# Altium project FSAE Formula E PDM.PrjPcb
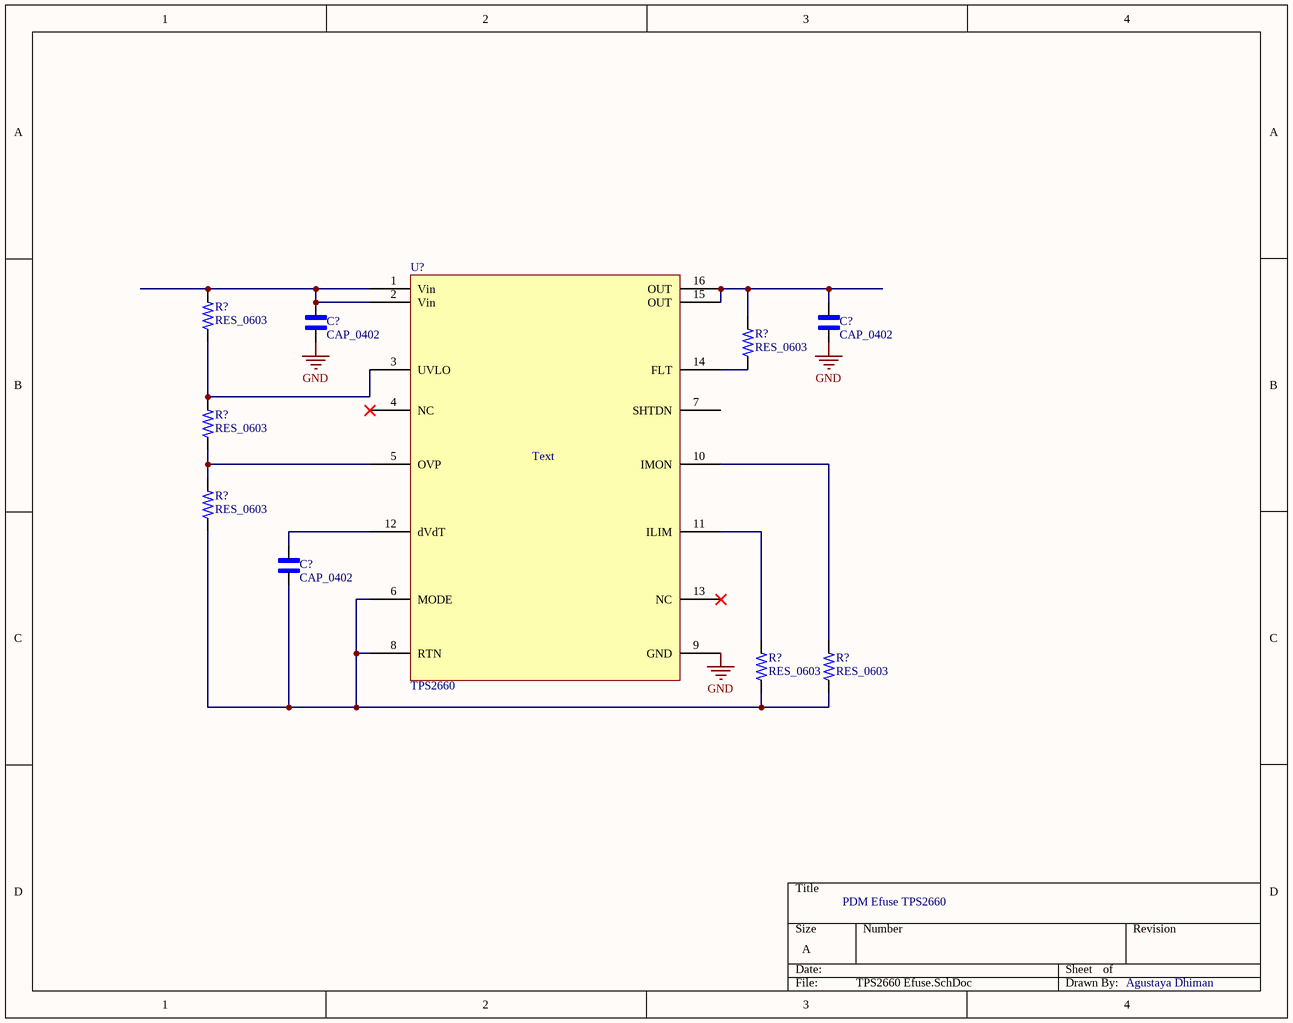
[diagram p0: TPS2660 Efuse.SchDoc]
3 sheets, 52 parts. Net scope: global (net labels, ports and power ports of the same name join across sheets).
Sheets:
  TPS2660 Efuse.SchDoc
  PDM_MCU_STM32F407GT6.SchDoc
  PDM_MCU_Power.SchDoc

## Sheet TPS2660 Efuse.SchDoc
size A; SheetNumber: 1; SheetTotal: 4

### Parts
(Parts that share a designator on the sheet are numbered #1, #2 ... from top to bottom, then left to right.)
C?#1  CAP_0402  [CAP_0402-Footprint-1]
C?#2  CAP_0402  [CAP_0402-Footprint-1]
C?#3  CAP_0402  [CAP_0402-Footprint-1]
R?#1  RES_0603  [RES_0603-Footprint-1]
R?#2  RES_0603  [RES_0603-Footprint-1]
R?#3  RES_0603  [RES_0603-Footprint-1]
R?#4  RES_0603  [RES_0603-Footprint-1]
R?#5  RES_0603  [RES_0603-Footprint-1]
R?#6  RES_0603  [RES_0603-Footprint-1]
U?#1  TPS2660

### Nets
GND: C?#1.1 C?#2.1 U?#1.9(GND)
NetC?#1_2: C?#1.2 R?#1.2 U?#1.1(Vin) U?#1.2(Vin)
NetC?#2_2: C?#2.2 R?#2.2 U?#1.15(OUT) U?#1.16(OUT)
NetC?#3_1: C?#3.1 R?#4.1 R?#5.1 R?#6.1 U?#1.6(MODE) U?#1.8(RTN)
NetC?#3_2: C?#3.2 U?#1.12(dVdT)
NetR?#1_1: R?#1.1 R?#3.2 U?#1.3(UVLO)
NetR?#2_1: R?#2.1 U?#1.14(FLT)
NetR?#3_1: R?#3.1 R?#4.2 U?#1.5(OVP)
NetR?#5_2: R?#5.2 U?#1.11(ILIM)
NetR?#6_2: R?#6.2 U?#1.10(IMON)

Not connected (* = marked no-connect by the designer): U?#1 4(NC)* 7(SHTDN) 13(NC)*

### Notes on the sheet
- PDM Efuse TPS2660
- Agustaya Dhiman
- (in symbol TPS2660) Text

### Library data of the parts
C?#1-C?#3 = CMP-00063-1: Generic 0402 Capacitor
R?#1-R?#6 = CMP-00013-5: 0603 Generic Resistor
U?#1 = TPS2660: TPS2660x, Efuse; ComponentLink1Description: DataSheet; ComponentLink1URL: https://www.ti.com/lit/ds/symlink/tps2660.pdf?ts=1762009075200

## Sheet PDM_MCU_STM32F407GT6.SchDoc
size A; SheetNumber: 3; SheetTotal: 4
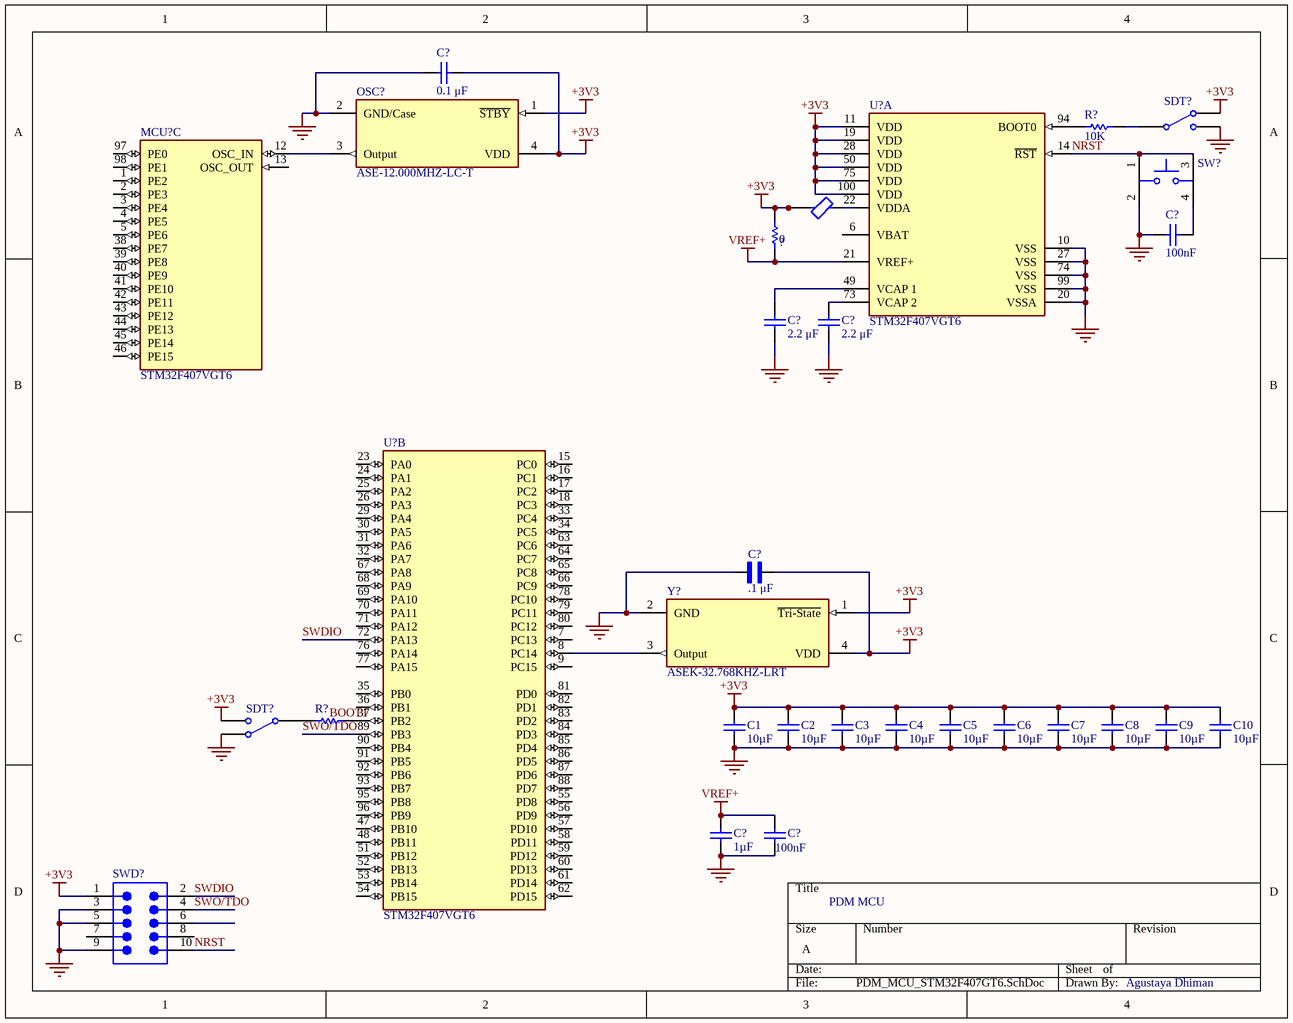
[diagram p1: PDM_MCU_STM32F407GT6.SchDoc]

### Parts
(Parts that share a designator on the sheet are numbered #1, #2 ... from top to bottom, then left to right.)
?  value 0  (hidden comment: Resistor)
C1  value 10µF  (hidden comment: Capacitor)
C2  value 10µF  (hidden comment: Capacitor)
C3  value 10µF  (hidden comment: Capacitor)
C4  value 10µF  (hidden comment: Capacitor)
C5  value 10µF  (hidden comment: Capacitor)
C6  value 10µF  (hidden comment: Capacitor)
C7  value 10µF  (hidden comment: Capacitor)
C8  value 10µF  (hidden comment: Capacitor)
C9  value 10µF  (hidden comment: Capacitor)
C10  value 10µF  (hidden comment: Capacitor)
C?#4  value 0.1 μF  (hidden comment: Capacitor)
C?#5  value 100nF  (hidden comment: Capacitor)
C?#6  value 2.2 μF  (hidden comment: Capacitor)
C?#7  value 2.2 μF  (hidden comment: Capacitor)
C?#8  .1 μF  [CAP_0603-Footprint]
C?#9  value 1µF  (hidden comment: Capacitor)
C?#10  value 100nF  (hidden comment: Capacitor)
FB?  BLM03BB750SZ1D  [FP-BLM03-0_03-d0_3-IPC_C]  (value not drawn)
MCU?  STM32F407VGT6  [FP-LQFP100-1L-MFG]  (part C of 3)
OSC?  ASE-12.000MHZ-LC-T  [FP-ASE-MFG]
R?#7  value 10K  (hidden comment: Resistor)
R?#8  Resistor  (value not drawn)
SDT?#1  Single-Pole, Double-Throw Switch  (value not drawn)
SDT?#2  Single-Pole, Double-Throw Switch  (value not drawn)
SW?  KT11P3JM34LFS  [FP-KT11P3JM34LFS-MFG]  (value not drawn)
SWD?  LTMM-105-02-T-D-SM  [SMTC-LTMM-105-02-X-D-SM]  (value not drawn)
U?#2  STM32F407VGT6  [FP-LQFP100-1L-MFG]  (part A of 3)
U?#3  STM32F407VGT6  [FP-LQFP100-1L-MFG]  (part B of 3)
Y?  ASEK-32.768KHZ-LRT  [FP-ASEK-ASEAIG-MFG]

### Nets
+3V3: ?.1 C1.2 C2.2 C3.2 C4.2 C5.2 C6.2 C7.2 C8.2 C9.2 C10.2 C?#4.2 C?#8.2 FB?.2 OSC?.1(~{STBY}) OSC?.4(VDD) SDT?#1.3 SDT?#2.2 SWD?.1 U?#2.11(VDD) U?#2.19(VDD) U?#2.28(VDD) U?#2.50(VDD) U?#2.75(VDD) U?#2.100(VDD) Y?.1(~{Tri-State}) Y?.4(VDD)
\: C?#4.1 C?#5.2 C?#8.1 OSC?.2(GND/Case) SW?.2 Y?.2(GND)
GND: C?#6.2 C?#7.2 SDT?#1.2 U?#2.10(VSS) U?#2.20(VSSA) U?#2.27(VSS) U?#2.74(VSS) U?#2.99(VSS)
NetC1_1: C1.1 C2.1 C3.1 C4.1 C5.1 C6.1 C7.1 C8.1 C9.1 C10.1 C?#9.1 C?#10.1 SDT?#2.3 SWD?.3 SWD?.5 SWD?.9
VREF+: ?.2 C?#9.2 C?#10.2 U?#2.21(VREF+)
NRST: SW?.1 SW?.3 SWD?.10 U?#2.14(~{RST})
SWDIO: SWD?.2 U?#3.72(PA13)
SWO/TDO: SWD?.4 U?#3.89(PB3)
NetC?#5_1: C?#5.1 SW?.4
NetC?#6_1: C?#6.1 U?#2.49(VCAP_1)
NetC?#7_1: C?#7.1 U?#2.73(VCAP_2)
NetFB?_1: FB?.1 U?#2.22(VDDA)
NetMCU?_12: MCU?.12(OSC_IN) OSC?.3(Output)
NetR?#7_1: R?#7.1 U?#2.94(BOOT0)
NetR?#7_2: R?#7.2 SDT?#1.1
NetR?#8_1: R?#8.1 SDT?#2.1
NetR?#8_2: R?#8.2 U?#3.37(PB2)
NetU?#3_8: U?#3.8(PC14) Y?.3(Output)

Not connected (* = marked no-connect by the designer): MCU? 1(PE2) 2(PE3) 3(PE4) 4(PE5) 5(PE6) 13(OSC_OUT) 38(PE7) 39(PE8) 40(PE9) 41(PE10) 42(PE11) 43(PE12) 44(PE13) 45(PE14) 46(PE15) 97(PE0) 98(PE1); SWD? 6 7 8; U?#2 6(VBAT); U?#3 7(PC13) 9(PC15) 15(PC0) 16(PC1) 17(PC2) 18(PC3) 23(PA0) 24(PA1) 25(PA2) 26(PA3) 29(PA4) 30(PA5) 31(PA6) 32(PA7) 33(PC4) 34(PC5) 35(PB0) 36(PB1) 47(PB10) 48(PB11) 51(PB12) 52(PB13) 53(PB14) 54(PB15) 55(PD8) 56(PD9) 57(PD10) 58(PD11) 59(PD12) 60(PD13) 61(PD14) 62(PD15) 63(PC6) 64(PC7) 65(PC8) 66(PC9) 67(PA8) 68(PA9) 69(PA10) 70(PA11) 71(PA12) 76(PA14) 77(PA15) 78(PC10) 79(PC11) 80(PC12) 81(PD0) 82(PD1) 83(PD2) 84(PD3) 85(PD4) 86(PD5) 87(PD6) 88(PD7) 90(PB4) 91(PB5) 92(PB6) 93(PB7) 95(PB8) 96(PB9)

### Notes on the sheet
- PDM MCU
- Agustaya Dhiman
- Labels drawn without touching a wire or pin: BOOT1

### Library data of the parts
? = Resistor: SimulationGenericComponent: True; TC1: 0; TC2: 0
C1-C10 C?#4-C?#7 C?#9 C?#10 = Capacitor: SimulationGenericComponent: True
C?#8 = CMP-022-000000-4: 0.1µF ±10% 50V Ceramic 0603; Manufacturer Part Number 1: CL10B104KB8NNNC; Manufacturer 1: Samsung Electro-Mechanics
FB? = CMP-06046-002018-1: Ferrite Bead, 0201, 75Ω @ 100MHz, 25%, 1Ω, 200mA; DC Resistance (DCR): 1R; Number of Lines: 1; Ratings: AEC-Q200; Max Current Rating: 200mA; Min Operating Temperature: -55°C; Max Operating Temperature: 125°C; RoHS Compliant: Yes; Case/Package: 0201; Mount: Surface Mount
MCU? U?#2 U?#3 = CMP-0243-00017-5: NexarPartId: 20570110; Manufacturer Package Identifier: 1L_ME_V5; Peripherals: Brown-out Detect/Reset, DMA, I2C, LCD, POR, PWM, WDT; Number of Programmable I/O: 82; Oscillator Type: Internal; Nominal Supply Current: 1.7µA; Number of Timers/Counters: 14; RAM Size: 192kB; Number of D/A Converters: 2; Number of Ethernet Channels: 1; Max Frequency: 168MHz; Number of SPI Channels: 3; Data Bus Width: 32b; Number of ADC Channels: 16; Max Supply Voltage: 3.6V; Number of USART Channels: 4; Interface: CAN, Ethernet, I2C, I2S, IrDA, LIN, SPI, UART, USART, USB; Max Junction Temperature (Tj): 125°C; Core Architecture: ARM Cortex-M4; Watchdog Timer: Yes; Memory Size: 1MB; Memory Type: FLASH; Min Supply Voltage: 1.8V; Number of I/Os: 82; Lead Free: Lead Free; Lifecycle Status: Production; Radiation Hardening: No; Frequency: 168MHz; Max Operating Temperature: 85°C; Height: 1.45mm; Number of Pins: 100; Number of I2C Channels: 3; Number of USB Channels: 1; REACH SVHC: No SVHC; Length: 14.2mm; Ambient Temperature Range High: 85°C; Schedule B: 8542310000, 8542310000; Number of Channels: 16; Number of A/D Converters: 3; Width: 14.2mm; Case/Package: LQFP; Flash Memory Size: 1MB; Min Operating Temperature: -40°C; Address Bus Width: 32b; Number of UART Channels: 2; RoHS: Compliant; Number of PWM Channels: 2
OSC? = CMP-27762-006076-1: XTAL Oscillator 12MHz ±50ppm CMOS 3.3V 4-SMD 3.2mm x 2.5mm; Load Capacitance: 15pF; Min Supply Voltage: 3.135V; Max Supply Current: 7mA; Max Supply Voltage: 3.465V; Series: ASE; Number of Pins: 4; Operating Frequency: 12 MHz; Operating Supply Voltage: 3.3V; Packaging: Tape and Reel; Package Quantity: 1000; Lead Free: Lead Free; REACH SVHC: No SVHC; Max Operating Temperature: 85°C; Frequency: 12MHz; Height: 0.047inch; Frequency Stability: 50ppm; Length: 3.2mm; Width: 0.098inch; Radiation Hardening: No; Mount: Surface Mount; Termination: SMD/SMT; Depth: 2.5mm; Case/Package: SMD/SMT; Min Operating Temperature: -40°C
R?#7 = Resistor: TC1: 0; SimulationGenericComponent: True; TC2: 0
R?#8 = Resistor: TC1: 0; SimulationGenericComponent: True; Value: 10K; TC2: 0
SDT?#1 SDT?#2 = SPDT SW: nodeUP_closed: 1; Rclosed: 1m; Ropen: 1Meg; SimulationGenericComponent: True
SW? = CMP-10040-000015-1: SWITCH TACTILE SPST-NO 1VA 32V; Manufacturer: C&K Components; Operating Force: 300gf; Standoff Height: 0.14mm; Electromechanical Life: 100000Cycles; Contact Resistance: 50mΩ; Throw Configuration: SPST-NO; Temperature: -40°C to +90°C; Mount: Surface Mount; Voltage Rating Dc: 32V; Automotive: No; Category: Switch; RoHS: TRUE; Mouser Description: Tactile Switches 1.12Mm Silvr J-Lead; Height: 4.1mm; Device Class L2: Switches; Voltage Rating Ac: 32V; Lead Free: Yes; Digikey Description: SWITCH TACTILE SPST-NO 1VA 32V; Temperature Range Low: -40°C; Manufacturer Part Number: KT11P3JM34LFS; ComponentLink2URL: https://dznh3ojzb2azq.cloudfront.net/products/Tactile/KT/documents/datasheet.pdf; Package: 0; Octopart: https://octopart.com/kt11p3jm34lfs-c%26k+components-55425764; ComponentLink2Description: Datasheet; Device Class L3: Tactile Switches; Temperature Range High: +90°C; Device Class L1: Electromechanical
SWD? = CMP-1028-00001-1: Shrouded Header & Stacker, Surface Mount, Vertical, -55 to 105 degC, 2 mm Pitch, 10-Pin, Male, RoHS; Manufacturer: Samtec; Pitch: 2 mm; Temperature Range: -55 to 105 degC; ComponentLink2URL: http://d2a072wq521u33.cloudfront.net/catalog_english//LTMM.PDF; ComponentLink1URL: http://www.samtec.com; ComponentLink3Description: Package Specification; ComponentLink3URL: http://www.samtec.com/documents/webfiles/cpdf/LTMM-1XX-XX-XX-D-XX-XX-MKT.pdf; ComponentLink1Description: Manufacturer URL; Orientation: Vertical; PackageVersion: AQ, 5/1992; PartNumber: LTMM-105-02-T-D-SM; PackageDescription: LTMM Assembly; DatasheetVersion: F-214; PackageReference: LTMM-105-02-X-D-SM; RoHS: True; ComponentLink2Description: Datasheet; Mounting Technology: Surface Mount
Y? = CMP-27762-000009-3: XTAL Oscillator 32.768kHz ±25ppm CMOS 3.3V 4-SMD 3.2mm x 2.5mm; Max Supply Current: 3.5mA; Min Supply Voltage: 2.97V; Load Capacitance: 15pF; Max Supply Voltage: 3.63V; Series: ASEK; Frequency: 32.768kHz; Operating Supply Voltage: 3.3V; Max Operating Temperature: 85°C; Case/Package: SMD/SMT; Frequency Stability: 25ppm; Depth: 2.5mm; Lead Free: Lead Free; Min Operating Temperature: -40°C; Termination: SMD/SMT; Length: 3.2mm; REACH SVHC: No SVHC; Mount: Surface Mount; Number of Pins: 4; Radiation Hardening: No; Operating Frequency: 32.768 kHz; Height: 0.047inch; Packaging: Tape and Reel; Width: 0.098inch

## Sheet PDM_MCU_Power.SchDoc
size A; SheetNumber: 4; SheetTotal: 4
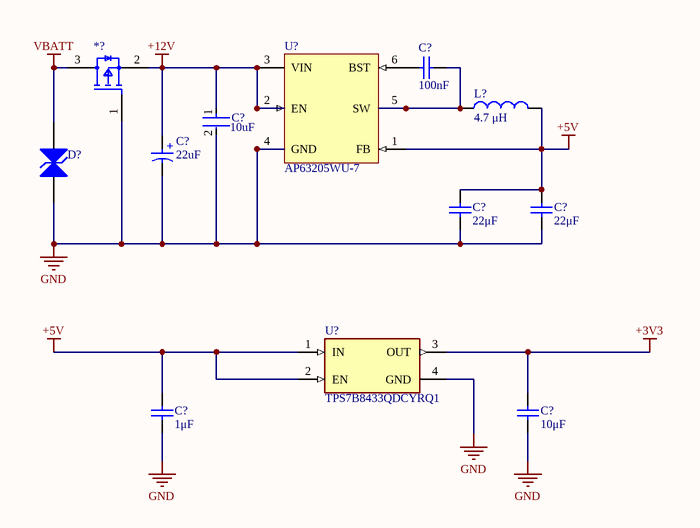
[diagram p2: PDM_MCU_Power.SchDoc]

### Parts
(Parts that share a designator on the sheet are numbered #1, #2 ... from top to bottom, then left to right.)
*?  DMP3099L-7  [SOT95P242X110-3N]  (value not drawn)
C?#11  value 100nF  (hidden comment: Capacitor)
C?#12  value 10uF  [FP-GRM188-0_2-IPC_C]  (hidden comment: GRM188R61E106KA73D)
C?#13  value 22uF  [WCAP-ASLI_D5H5.5]  (hidden comment: 865080442004)
C?#14  value 22μF  (hidden comment: Capacitor)
C?#15  value 22μF  (hidden comment: Capacitor)
C?#16  value 1μF  (hidden comment: Capacitor)
C?#17  value 10μF  (hidden comment: Capacitor)
D?  SMAJ13CA-E3/61  [VISH-DO-214AC-2_N]  (value not drawn)
L?  value 4.7 μH  (hidden comment: Inductor)
U?#4  AP63205WU-7  [FP-TSOT26-IPC_B]
U?#5  TPS7B8433QDCYRQ1  [FP-DCY0004A-MFG]

### Nets
+3V3: C?#17.1 U?#5.3(OUT)
+5V: C?#14.2 C?#15.2 C?#16.1 L?.2 U?#4.1(FB) U?#5.1(IN) U?#5.2(EN)
+12V: *?.2(Source) C?#12.1 C?#13.1(P) U?#4.2(EN) U?#4.3(VIN)
GND: *?.1(Gate) C?#12.2 C?#13.2(N) C?#14.1 C?#15.1 C?#16.2 C?#17.2 D?.1(A1) U?#4.4(GND) U?#5.4(GND)
VBATT: *?.3(Drain) D?.2(A2)
NetC?#11_1: C?#11.1 U?#4.6(BST)
NetC?#11_2: C?#11.2 L?.1 U?#4.5(SW)

### Notes on the sheet
- (in symbol CMP-00027-1) +

### Library data of the parts
*? = CMP-00025-2: Mosfet P-CH 30V 3.8A Vgs(ON) = -10V SOT23; Manufacturer 1: Diodes Incorporated; Manufacturer Part Number 1: DMP3099L-7; Digikey Part Number: DMP3099L-7DICT-ND
C?#11 C?#14-C?#17 = Capacitor: SimulationGenericComponent: True
C?#12 = CMP-00004-2: 10 uF, 25 V, ± 10%, X5R, 0603 [1608 Metric]; Voltage Rating: 25V; Material: Ceramic; Height: 1mm; Max Operating Temperature: 85°C; Thickness: 800um; Tolerance: 10%; Min Operating Temperature: -55°C; RoHS Compliant: Yes; Mounting Technology: Surface Mount; Voltage Rating (DC): 25V; Dielectric: X5R; Case/Package: 0603; Width: 800um; Series: GRM; Length: 1.6mm
C?#13 = CMP-00027-1: 22uF/25V Alum / For battery transients; Manufacturer 1: Würth Elektronik; Manufacturer Part Number 1: 865080442004
D? = CMP-0548-00189-2: Transient Voltage Suppressor, 6.40 to 231 V, 13 V Stand-off Voltage, Bi-Directional, -55 to 155 degC, 2-pin DO-214AC, Pb-Free, Tape and Reel; Manufacturer: Vishay Semiconductor; PPPM (W): 400, 300; VWM (V): 13; ID (uA): 2; IFSM: 40 A; VBR Bi-Directional (V): 6.4 to 231; Mounting Technology: Surface Mount; ComponentLink1Description: Manufacturer URL; ComponentLink3URL: http://www.vishay.com/docs/88390/smaj50a.pdf; PackageDescription: 2-Pin DO-214AC (SMA), Body 4.245 x 2.665 mm; Operating Junction and Storage Temperature Range: -55 to 150 degC; RoHS: TRUE; ComponentLink2URL: http://www.vishay.com/docs/88390/smaj50a.pdf; ComponentLink3Description: Package Specification; PartNumber: SMAJ13CA-E3/61; DatasheetVersion: 12/8/2013; PackageReference: DO-214AC-2; ComponentLink2Description: Datasheet; ComponentLink1URL: http://www.vishay.com/; Packing: Tape and Reel
L? = Inductor: SimulationGenericComponent: True
U?#4 = CMP-00003-5: AP63205 Series 32 V 2 A 1.1 MHz Synchronous Buck Converter -TSOT-26; Manufacturer 1: Diodes Incorporated; Manufacturer Part Number 1: AP63205WU-7; Digikey Part Number: AP63205WU-7DICT-ND
U?#5 = CMP-04917-000330-1: IC REG LIN 3.3V 150MA SOT223-4

## Nets that join several sheets
+3V3: PDM_MCU_STM32F407GT6 (27 pins), PDM_MCU_Power (C?#17.1 U?#5.3)
GND: TPS2660 Efuse (C?#1.1 C?#2.1 U?#1.9), PDM_MCU_STM32F407GT6 (8 pins), PDM_MCU_Power (10 pins)